# Altium schematic sheet top.SchDoc
size A
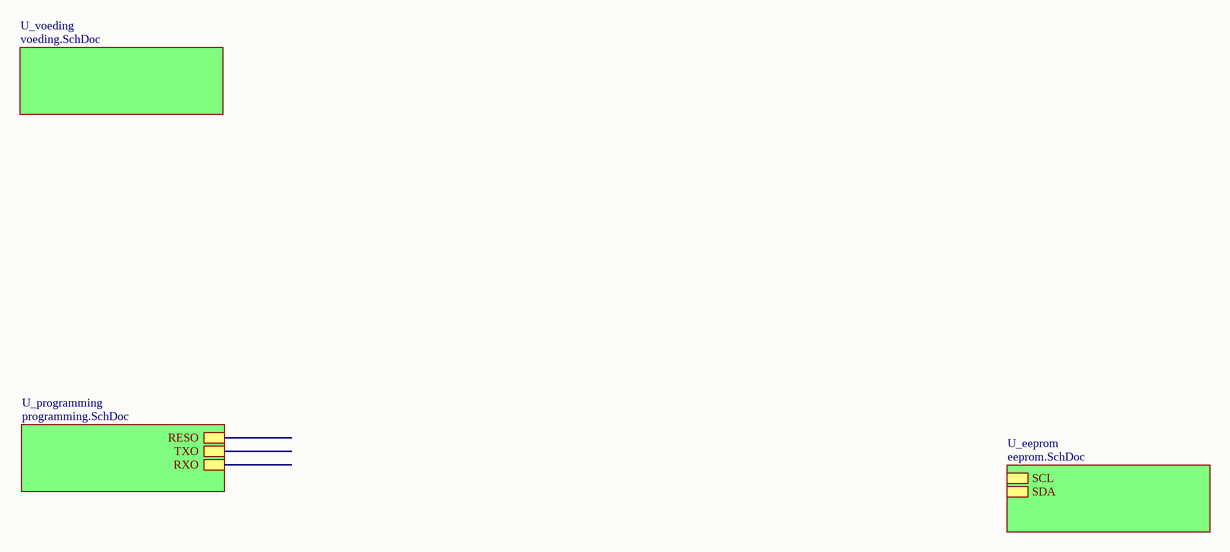
[diagram p0: top.SchDoc]

## Sub-sheets
U_eeprom = eeprom.SchDoc: SCL, SDA
U_programming = programming.SchDoc: RESO, TXO, RXO
U_voeding = voeding.SchDoc: no entries